# Altium schematic sheet Sheet5.SchDoc
size A0; SheetNumber: 9; SheetTotal: 9
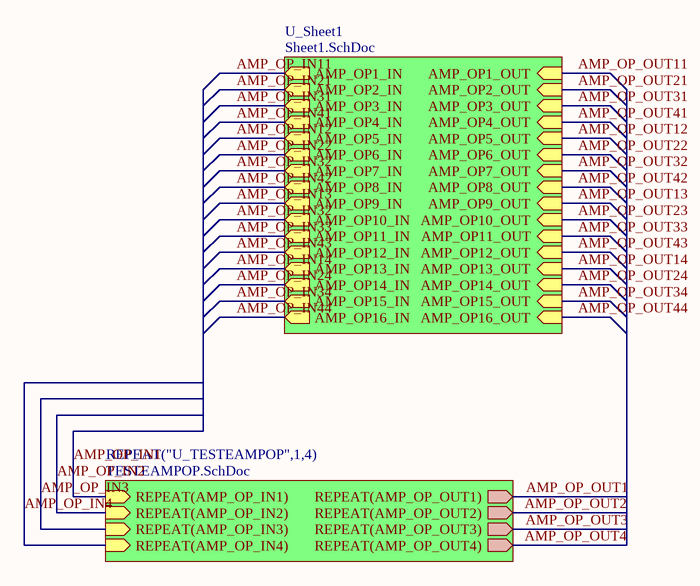
[diagram p0: Sheet5.SchDoc]

## Sub-sheets
REPEAT("U_TESTEAMPOP",1,4) = TESTEAMPOP.SchDoc: REPEAT(AMP_OP_IN2) (in), REPEAT(AMP_OP_IN3) (in), REPEAT(AMP_OP_IN4) (in), REPEAT(AMP_OP_OUT3) (out), REPEAT(AMP_OP_OUT4) (out), REPEAT(AMP_OP_IN1) (in), REPEAT(AMP_OP_OUT2) (out), REPEAT(AMP_OP_OUT1) (out)
U_Sheet1 = Sheet1.SchDoc: AMP_OP1_IN (out), AMP_OP2_IN (out), AMP_OP3_IN (out), AMP_OP4_IN (out), AMP_OP1_OUT (in), AMP_OP2_OUT (in), AMP_OP3_OUT (in), AMP_OP4_OUT (in), AMP_OP5_IN (out), AMP_OP6_IN (out), AMP_OP7_IN (out), AMP_OP8_IN (out), AMP_OP5_OUT (in), AMP_OP6_OUT (in), AMP_OP7_OUT (in), AMP_OP8_OUT (in), AMP_OP9_IN (out), AMP_OP10_IN (out), AMP_OP11_IN (out), AMP_OP12_IN (out), AMP_OP13_IN (out), AMP_OP14_IN (out), AMP_OP15_IN (out), AMP_OP16_IN (out), AMP_OP9_OUT (in), AMP_OP10_OUT (in), AMP_OP11_OUT (in), AMP_OP12_OUT (in), AMP_OP13_OUT (in), AMP_OP14_OUT (in), AMP_OP15_OUT (in), AMP_OP16_OUT (in)

## Nets
AMP_OP_IN1: sheet REPEAT("U_TESTEAMPOP",1,4)/REPEAT(AMP_OP_IN1)
AMP_OP_IN2: sheet REPEAT("U_TESTEAMPOP",1,4)/REPEAT(AMP_OP_IN2)
AMP_OP_IN3: sheet REPEAT("U_TESTEAMPOP",1,4)/REPEAT(AMP_OP_IN3)
AMP_OP_IN4: sheet REPEAT("U_TESTEAMPOP",1,4)/REPEAT(AMP_OP_IN4)
AMP_OP_IN11: sheet U_Sheet1/AMP_OP1_IN
AMP_OP_IN12: sheet U_Sheet1/AMP_OP5_IN
AMP_OP_IN13: sheet U_Sheet1/AMP_OP9_IN
AMP_OP_IN14: sheet U_Sheet1/AMP_OP13_IN
AMP_OP_IN21: sheet U_Sheet1/AMP_OP2_IN
AMP_OP_IN22: sheet U_Sheet1/AMP_OP6_IN
AMP_OP_IN24: sheet U_Sheet1/AMP_OP14_IN
AMP_OP_IN31: sheet U_Sheet1/AMP_OP3_IN
AMP_OP_IN32: sheet U_Sheet1/AMP_OP7_IN, sheet U_Sheet1/AMP_OP10_IN
AMP_OP_IN33: sheet U_Sheet1/AMP_OP11_IN
AMP_OP_IN34: sheet U_Sheet1/AMP_OP15_IN
AMP_OP_IN41: sheet U_Sheet1/AMP_OP4_IN
AMP_OP_IN42: sheet U_Sheet1/AMP_OP8_IN
AMP_OP_IN43: sheet U_Sheet1/AMP_OP12_IN
AMP_OP_IN44: sheet U_Sheet1/AMP_OP16_IN
AMP_OP_OUT1: sheet REPEAT("U_TESTEAMPOP",1,4)/REPEAT(AMP_OP_OUT1)
AMP_OP_OUT2: sheet REPEAT("U_TESTEAMPOP",1,4)/REPEAT(AMP_OP_OUT2)
AMP_OP_OUT3: sheet REPEAT("U_TESTEAMPOP",1,4)/REPEAT(AMP_OP_OUT3)
AMP_OP_OUT4: sheet REPEAT("U_TESTEAMPOP",1,4)/REPEAT(AMP_OP_OUT4)
AMP_OP_OUT11: sheet U_Sheet1/AMP_OP1_OUT
AMP_OP_OUT12: sheet U_Sheet1/AMP_OP5_OUT
AMP_OP_OUT13: sheet U_Sheet1/AMP_OP9_OUT
AMP_OP_OUT14: sheet U_Sheet1/AMP_OP13_OUT
AMP_OP_OUT21: sheet U_Sheet1/AMP_OP2_OUT
AMP_OP_OUT22: sheet U_Sheet1/AMP_OP6_OUT
AMP_OP_OUT23: sheet U_Sheet1/AMP_OP10_OUT
AMP_OP_OUT24: sheet U_Sheet1/AMP_OP14_OUT
AMP_OP_OUT31: sheet U_Sheet1/AMP_OP3_OUT
AMP_OP_OUT32: sheet U_Sheet1/AMP_OP7_OUT
AMP_OP_OUT33: sheet U_Sheet1/AMP_OP11_OUT
AMP_OP_OUT34: sheet U_Sheet1/AMP_OP15_OUT
AMP_OP_OUT41: sheet U_Sheet1/AMP_OP4_OUT
AMP_OP_OUT42: sheet U_Sheet1/AMP_OP8_OUT
AMP_OP_OUT43: sheet U_Sheet1/AMP_OP12_OUT
AMP_OP_OUT44: sheet U_Sheet1/AMP_OP16_OUT